# EAGLE design Patch (EAGLE 6.2)
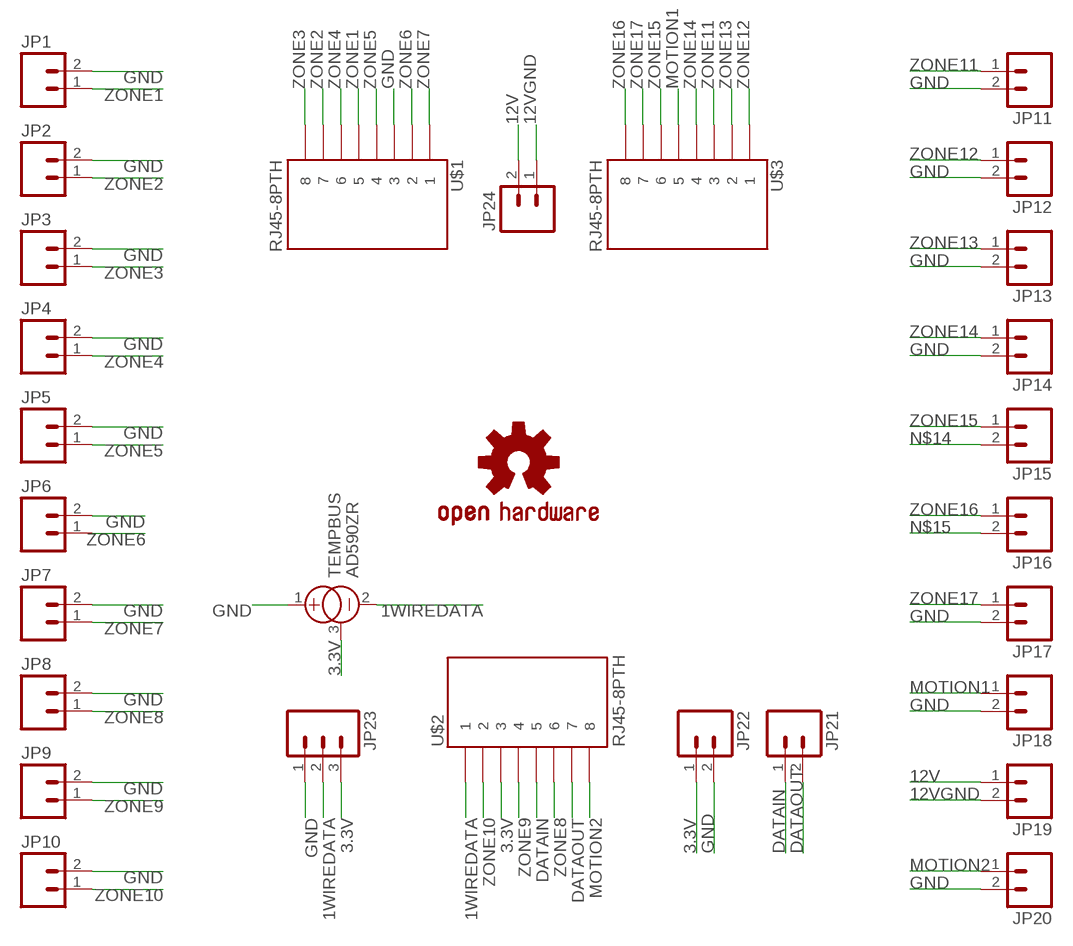
[diagram p0: schematic, sheet 1]

## Parts
JP1  M023.5MM  [SCREWTERMINAL-3.5MM-2]
JP2  M023.5MM  [SCREWTERMINAL-3.5MM-2]
JP3  M023.5MM  [SCREWTERMINAL-3.5MM-2]
JP4  M023.5MM  [SCREWTERMINAL-3.5MM-2]
JP5  M023.5MM  [SCREWTERMINAL-3.5MM-2]
JP6  M023.5MM  [SCREWTERMINAL-3.5MM-2]
JP7  M023.5MM  [SCREWTERMINAL-3.5MM-2]
JP8  M023.5MM  [SCREWTERMINAL-3.5MM-2]
JP9  M023.5MM  [SCREWTERMINAL-3.5MM-2]
JP10  M023.5MM  [SCREWTERMINAL-3.5MM-2]
JP11  M023.5MM  [SCREWTERMINAL-3.5MM-2]
JP12  M023.5MM  [SCREWTERMINAL-3.5MM-2]
JP13  M023.5MM  [SCREWTERMINAL-3.5MM-2]
JP14  M023.5MM  [SCREWTERMINAL-3.5MM-2]
JP15  M023.5MM  [SCREWTERMINAL-3.5MM-2]
JP16  M023.5MM  [SCREWTERMINAL-3.5MM-2]
JP17  M023.5MM  [SCREWTERMINAL-3.5MM-2]
JP18  M023.5MM  [SCREWTERMINAL-3.5MM-2]
JP19  M023.5MM  [SCREWTERMINAL-3.5MM-2]
JP20  M023.5MM  [SCREWTERMINAL-3.5MM-2]
JP21  M023.5MM  [SCREWTERMINAL-3.5MM-2]
JP22  M023.5MM  [SCREWTERMINAL-3.5MM-2]
JP23  M03SCREW  [SCREWTERMINAL-3.5MM-3]
JP24  M025MM  [SCREWTERMINAL-5MM-2]
TEMPBUS  AD590ZR  [TO92]
U$1  RJ45-8PTH  [RJ45-8]
U$2  RJ45-8PTH  [RJ45-8]
U$3  RJ45-8PTH  [RJ45-8]
U$4  OSHW-LOGOL  [OSHW-LOGO-L]

## Nets
1WIREDATA: JP23.2 TEMPBUS.2(-) U$2.1
3.3V: JP22.1 JP23.3 TEMPBUS.3(CAN) U$2.3
12V: JP19.1 JP24.2
12VGND: JP19.2 JP24.1
DATAIN: JP21.1 U$2.5
DATAOUT: JP21.2 U$2.7
GND: JP1.2 JP2.2 JP3.2 JP4.2 JP5.2 JP6.2 JP7.2 JP8.2 JP9.2 JP10.2 JP11.2 JP12.2 JP13.2 JP14.2 JP17.2 JP18.2 JP20.2 JP22.2 JP23.1 TEMPBUS.1(+) U$1.3
MOTION1: JP18.1 U$3.5
MOTION2: JP20.1 U$2.8
N$14: JP15.2
N$15: JP16.2
ZONE1: JP1.1 U$1.5
ZONE2: JP2.1 U$1.7
ZONE3: JP3.1 U$1.8
ZONE4: JP4.1 U$1.6
ZONE5: JP5.1 U$1.4
ZONE6: JP6.1 U$1.2
ZONE7: JP7.1 U$1.1
ZONE8: JP8.1 U$2.6
ZONE9: JP9.1 U$2.4
ZONE10: JP10.1 U$2.2
ZONE11: JP11.1 U$3.3
ZONE12: JP12.1 U$3.1
ZONE13: JP13.1 U$3.2
ZONE14: JP14.1 U$3.4
ZONE15: JP15.1 U$3.6
ZONE16: JP16.1 U$3.8
ZONE17: JP17.1 U$3.7

## Library data of the parts
JP1-JP22 JP24 = SparkFun:M02: Header 2 Standard 2-pin 0.1" header. Use with straight break away headers (SKU : PRT-00116), right angle break away headers (PRT-00553), swiss pins (PRT-00743), machine pins (PRT-00117), and female headers (PRT-00115). Molex polarized connector foot print use with SKU : PRT-08233 with associated crimp pins and housings.
JP23 = SparkFun:M03: Header 3 Standard 3-pin 0.1" header. Use with straight break away headers (SKU : PRT-00116), right angle break away headers (PRT-00553), swiss pins (PRT-00743), machine pins (PRT-00117), and female headers (PRT-00115). Molex polarized connector foot print use with SKU : PRT-08232 with associated crimp pins and housings.
TEMPBUS = linear:AD590ZR: TEMPERATURE SENSOR current output
U$1-U$3 = SparkFun:RJ45-8: RJ45 Jack Simple RJ45, 8-pin connection - connector for common Cat5, Cat5e, and Cat6 Ethernet cables. Footprint not yet proven in production. Connector sku is PRT-00643; Breakout PCB sku is BOB-00716.
U$4 = SparkFun:OSHW-LOGO: Open Source Hardware Logo This logo indicates the piece of hardware it is found on incorporates a OSHW license and/or adheres to the definition of open source hardware found here: http://freedomdefined.org/OSHW

## Board
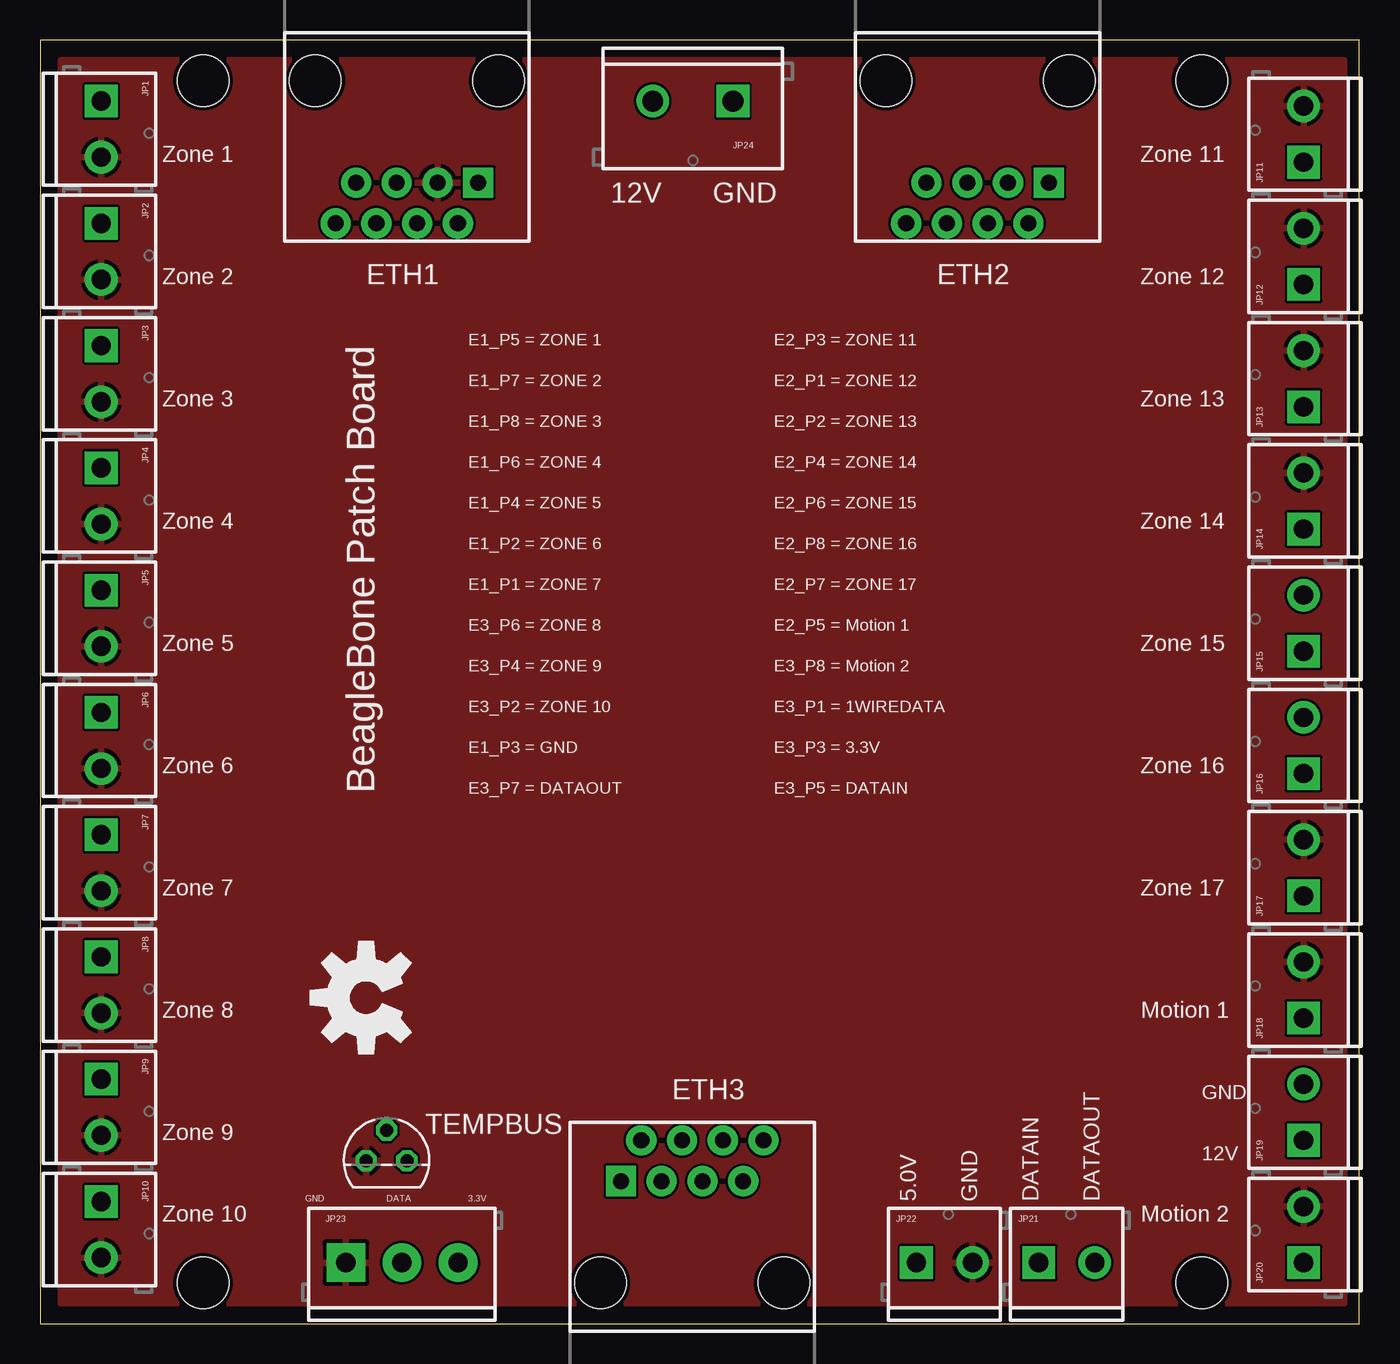
[diagram p1: board, top side]
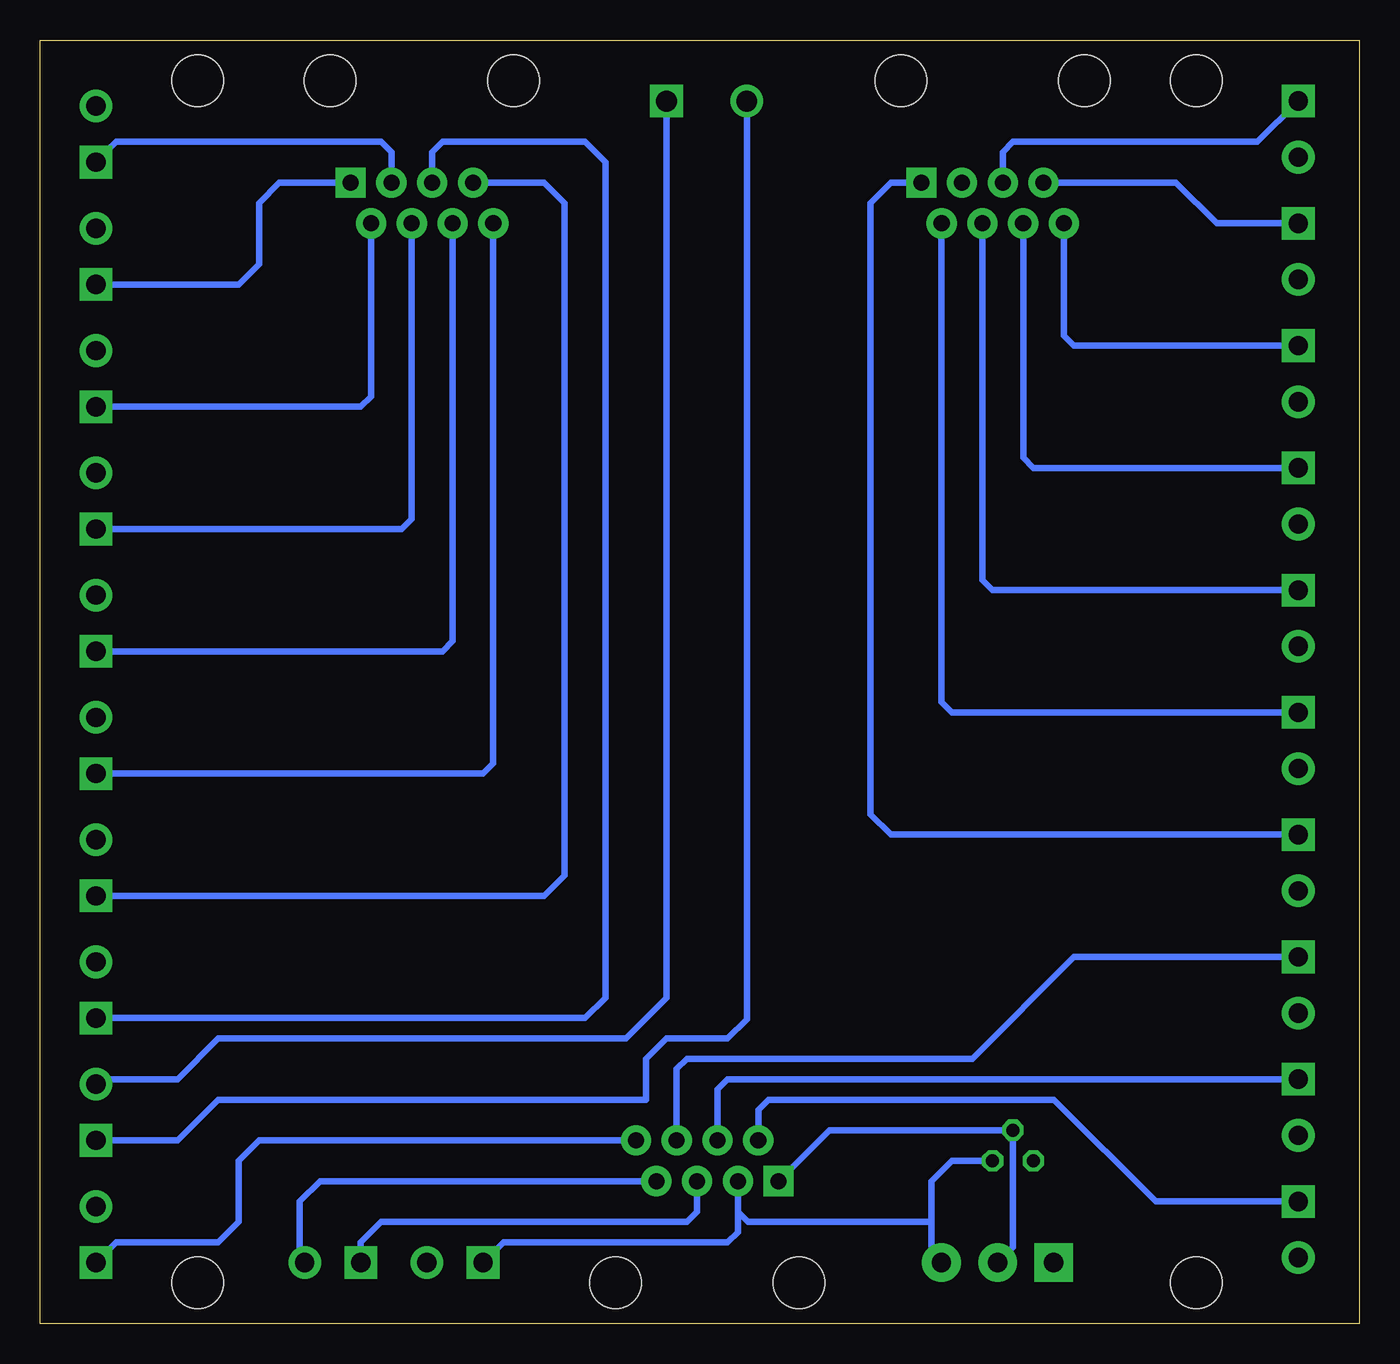
[diagram p2: board, bottom side, seen from below]

Size 82.22 x 80 mm. Coordinates in mm from the lower left corner, seen from the top.
Outline: 0,0 82.22,0 82.22,80 0,80 0,0
Copper layers (1*16): Top 0.035mm / dielectric 1.5mm / Bottom 0.035mm
Design rules: minimum track width 6mil, minimum drill 12mil, track to track 6mil, track to pad 6mil, pad to pad 6mil, via to via 6mil, smd to smd 0mil, copper to edge 10mil, drill to drill 10mil, minimum pad ring 10mil, minimum via ring 6mil, stop-mask expansion 2mil, vias tented up to drill 100mil, thermal gap 10mil
Holes 3.2 mm at 10.16,77.47 72.39,77.47 72.39,2.54 10.16,2.54

### Footprints (pad centres in the part's own frame; a part is rotated, then mirrored left to right if it is on the bottom)
SCREWTERMINAL-3.5MM-2 = drill 1.2 pad 2.032 square: 1 0,0 | drill 1.2 pad 2.032: 2 3.5,0
SCREWTERMINAL-3.5MM-3 = drill 1.2 pad 2.413 square: 1 0,0 | drill 1.2 pad 2.413: 2 3.5,0; 3 7,0
SCREWTERMINAL-5MM-2 = drill 1.3 pad 2.032 square: 1 0,0 | drill 1.3 pad 2.032: 2 5,0
TO92 = drill 0.813 octagon: 1 -1.27,0; 2 0,1.905; 3 1.27,0
RJ45-8 = drill 1 pad 1.88 square: 1 -4.445,6.35 | drill 1 pad 1.88: 2 -3.175,8.89; 3 -1.905,6.35; 4 -0.635,8.89; 5 0.635,6.35; 6 1.905,8.89; 7 3.175,6.35; 8 4.445,8.89 | hole 3.2: -5.715,0; 5.715,0

### Placement (x,y rotation side)
JP1  3.81,76.2 270 top
JP2  3.81,68.58 270 top
JP3  3.81,60.96 270 top
JP4  3.81,53.34 270 top
JP5  3.81,45.72 270 top
JP6  3.81,38.1 270 top
JP7  3.81,30.48 270 top
JP8  3.81,22.86 270 top
JP9  3.81,15.24 270 top
JP10  3.81,7.62 270 top
JP11  78.74,72.39 90 top
JP12  78.74,64.77 90 top
JP13  78.74,57.15 90 top
JP14  78.74,49.53 90 top
JP15  78.74,41.91 90 top
JP16  78.74,34.29 90 top
JP17  78.74,26.67 90 top
JP18  78.74,19.05 90 top
JP19  78.74,11.43 90 top
JP20  78.74,3.81 90 top
JP21  62.23,3.81 0 top
JP22  54.61,3.81 0 top
JP23  19.05,3.81 0 top
JP24  43.18,76.2 180 top
TEMPBUS  21.59,10.16 0 top
U$1  22.86,77.47 180 top
U$2  40.64,2.54 0 top
U$3  58.42,77.47 180 top
U$4  20.32,20.32 90 top

### Tracks (layer width: path | path; a pad name or v marks a point on that pad's centre or on a via)
1WIREDATA
  Bottom 0.406: U$2.1 33.02,12.06 TEMPBUS.2 21.59,4.77 JP23.2
3.3V
  Bottom 0.406: TEMPBUS.3 25.4,10.16 26.67,8.89 26.67,6.35 | 26.67,6.35 26.67,4.43 JP23.3 | U$2.3 38.73,6.99 | 38.73,6.99 38.1,6.35 26.67,6.35 | 38.73,6.99 38.73,5.71 39.37,5.08 53.34,5.08 JP22.1
12V
  Bottom 0.406: JP24.2 38.18,18.97 39.37,17.78 43.18,17.78 44.45,16.51 44.45,13.97 71.12,13.97 73.66,11.43 JP19.1
12VGND
  Bottom 0.406: JP24.1 43.18,20.32 45.72,17.78 71.12,17.78 73.66,15.24 78.43,15.24 JP19.2
DATAIN
  Bottom 0.406: U$2.5 41.27,6.99 41.91,6.35 60.96,6.35 62.23,5.08 JP21.1
DATAOUT
  Bottom 0.406: U$2.7 64.77,8.89 | 64.77,8.89 66.04,7.62 | 66.04,7.62 66.04,4.12 JP21.2 | 64.77,8.89 66.04,7.62
GND
  pour Top: 1.27,78.74 81.28,78.74 81.28,1.27 1.27,1.27
MOTION1
  Bottom 0.406: U$3.5 57.78,73.03 57.15,73.66 48.26,73.66 46.99,72.39 46.99,20.32 48.26,19.05 JP18.1
MOTION2
  Bottom 0.406: U$2.8 68.58,11.43 69.85,10.16 69.85,6.35 71.12,5.08 77.47,5.08 JP20.1
ZONE1
  Bottom 0.406: U$1.5 22.23,73.03 21.59,73.66 6.35,73.66 JP1.1
ZONE2
  Bottom 0.406: U$1.7 11.43,71.12 8.89,68.58 JP2.1
ZONE3
  Bottom 0.406: U$1.8 18.41,61.59 17.78,60.96 JP3.1
ZONE4
  Bottom 0.406: U$1.6 20.95,53.98 20.32,53.34 JP4.1
ZONE5
  Bottom 0.406: U$1.4 23.5,46.35 22.86,45.72 JP5.1
ZONE6
  Bottom 0.406: U$1.2 26.04,38.73 25.4,38.1 JP6.1
ZONE7
  Bottom 0.406: U$1.1 29.21,71.12 30.48,69.85 30.48,31.75 29.21,30.48 JP7.1
ZONE8
  Bottom 0.406: U$2.6 42.55,15.88 41.91,16.51 24.13,16.51 17.78,22.86 JP8.1
ZONE9
  Bottom 0.406: U$2.4 40.01,14.61 39.37,15.24 JP9.1
ZONE10
  Bottom 0.406: U$2.2 37.47,13.34 36.83,13.97 19.05,13.97 12.7,7.62 JP10.1
ZONE11
  Bottom 0.406: U$3.3 60.33,73.03 60.96,73.66 77.47,73.66 JP11.1
ZONE12
  Bottom 0.406: U$3.1 67.31,71.12 68.58,69.85 68.58,66.04 69.85,64.77 JP12.1
ZONE13
  Bottom 0.406: U$3.2 61.59,57.78 62.23,57.15 JP13.1
ZONE14
  Bottom 0.406: U$3.4 59.05,50.16 59.69,49.53 JP14.1
ZONE15
  Bottom 0.406: U$3.6 56.52,42.55 57.15,41.91 JP15.1
ZONE16
  Bottom 0.406: U$3.8 53.98,34.92 54.61,34.29 JP16.1
ZONE17
  Bottom 0.406: U$3.7 50.8,71.12 49.53,69.85 49.53,27.94 50.8,26.67 JP17.1

### Text on the board
tPlace: Zone 1 | Zone 11 | 12V | GND | Zone 2 | ETH1 | ETH2 | Zone 12 | BeagleBone Patch Board | E1_P5 = ZONE 1 | E2_P3 = ZONE 11 | E1_P7 = ZONE 2 | E2_P1 = ZONE 12 | Zone 3 | Zone 13 | E1_P8 = ZONE 3 | E2_P2 = ZONE 13 | E1_P6 = ZONE 4 | E2_P4 = ZONE 14 | E1_P4 = ZONE 5 | E2_P6 = ZONE 15 | Zone 4 | Zone 14 | E1_P2 = ZONE 6 | E2_P8 = ZONE 16 | E1_P1 = ZONE 7 | E2_P7 = ZONE 17 | E3_P6 = ZONE 8 | E2_P5 = Motion 1 | Zone 5 | Zone 15 | E3_P4 = ZONE 9 | E3_P8 = Motion 2 | E3_P2 = ZONE 10 | E3_P1 = 1WIREDATA | E1_P3 = GND | E3_P3 = 3.3V | Zone 6 | Zone 16 | E3_P7 = DATAOUT | E3_P5 = DATAIN | Zone 7 | Zone 17 | Zone 8 | Motion 1 | ETH3 | GND | Zone 9 | 12V | GND | DATA | 3.3V | 5.0V | GND | DATAIN | DATAOUT | Zone 10 | Motion 2